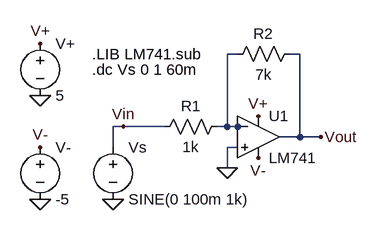
[diagram p0: schematic PL3.asc]
PL3.asc, the LTspice schematic file:
Version 4
SHEET 1 880 680
WIRE 224 32 208 32
WIRE 320 32 304 32
WIRE 48 144 32 144
WIRE 112 144 48 144
WIRE 208 144 208 32
WIRE 208 144 192 144
WIRE 224 144 224 128
WIRE 224 144 208 144
WIRE 320 160 320 32
WIRE 320 160 288 160
WIRE 352 160 320 160
WIRE 32 176 32 144
WIRE 224 176 208 176
WIRE 208 208 208 176
FLAG 256 128 V+
FLAG 256 192 V-
FLAG 352 160 Vout
FLAG 208 208 0
FLAG 32 256 0
FLAG -80 256 0
FLAG -80 96 0
FLAG 48 144 Vin
FLAG -80 16 V+
FLAG -80 176 V-
SYMBOL Opamps\\opamp2 256 96 R0
SYMATTR InstName U1
SYMATTR Value LM741
SYMBOL res 320 16 R90
WINDOW 0 0 56 VBottom 2
WINDOW 3 32 56 VTop 2
SYMATTR InstName R2
SYMATTR Value 7k
SYMBOL res 208 128 R90
WINDOW 0 0 56 VBottom 2
WINDOW 3 32 56 VTop 2
SYMATTR InstName R1
SYMATTR Value 1k
SYMBOL voltage 32 160 R0
WINDOW 123 0 0 Left 2
WINDOW 39 0 0 Left 2
SYMATTR InstName Vs
SYMATTR Value SINE(0 100m 1k)
SYMBOL voltage -80 160 R0
WINDOW 123 0 0 Left 2
WINDOW 39 0 0 Left 2
SYMATTR InstName V-
SYMATTR Value -5
SYMBOL voltage -80 0 R0
WINDOW 123 0 0 Left 2
WINDOW 39 0 0 Left 2
SYMATTR InstName V+
SYMATTR Value 5
TEXT 0 32 Left 2 !.LIB LM741.sub
TEXT 0 56 Left 2 !.dc Vs 0 1 60m

The netlist it stands for:
* PL3.asc
XU1 0 N001 V+ V- Vout LM741  ; pins In+ In- V+ V- OUT
R2 Vout N001 7k
R1 N001 Vin 1k
Vs Vin 0 SINE(0 100m 1k)
V- V- 0 -5
V+ V+ 0 5
.LIB LM741.sub
.dc Vs 0 1 60m
.backanno
.end